# Altium schematic sheet 07-LVDS.SchDoc
size A4; DocumentNumber: 28; SheetNumber: 28; SheetTotal: 34
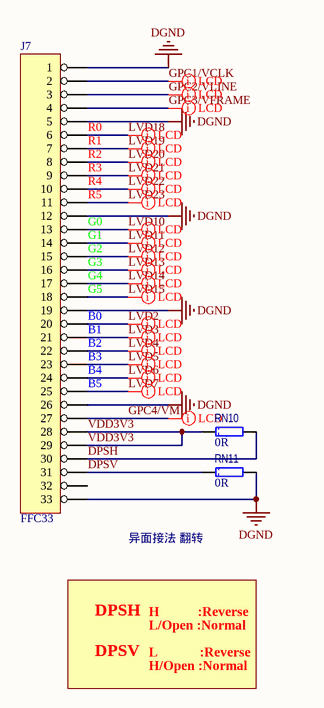
[diagram p0: 07-LVDS.SchDoc]

## Parts
J7  FFC33  [FFC/SM0.5-2H33]
RN10  value 0R  [1608[0603]RN]  (hidden comment: CRCW06030000ZSTA)
RN11  value 0R  [1608[0603]RN]  (hidden comment: CRCW06030000ZSTA)

## Nets
DGND: J7.1 J7.5 J7.12 J7.19 J7.26 J7.33 RN11.2
DPSH: J7.30 RN10.2
DPSV: J7.31 RN11.1
GPC1/VCLK: J7.2
GPC2/VLINE: J7.3
GPC3/VFRAME: J7.4
GPC4/VM: J7.27
LVD2: J7.20
LVD3: J7.21
LVD4: J7.22
LVD5: J7.23
LVD6: J7.24
LVD7: J7.25
LVD10: J7.13
LVD11: J7.14
LVD12: J7.15
LVD13: J7.16
LVD14: J7.17
LVD15: J7.18
LVD18: J7.6
LVD19: J7.7
LVD20: J7.8
LVD21: J7.9
LVD22: J7.10
LVD23: J7.11
VDD3V3: J7.28 J7.29 RN10.1

Not connected (* = marked no-connect by the designer): J7 32

## Layout directives
net class LCD: GPC1/VCLK, GPC2/VLINE, GPC3/VFRAME, GPC4/VM, LVD2, LVD3, LVD4, LVD5, LVD6, LVD7, LVD10, LVD11, LVD12, LVD13, LVD14, LVD15, LVD18, LVD19, LVD20, LVD21, LVD22, LVD23

## Notes on the sheet
- (near J7) R0
- (near J7) R1
- (near J7) R2
- (near J7) R3
- (near J7) R4
- (near J7) R5
- (near J7) G0
- (near J7) G1
- (near J7) G2
- (near J7) G3
- (near J7) G4
- (near J7) G5
- (near J7) B0
- (near J7) B1
- (near J7) B2
- (near J7) B3
- (near J7) B4
- (near J7) B5
- (near J7) 异面接法 翻转
- DPSH
- DPSV
- H           :Reverse
- L/Open :Normal
- L            :Reverse
- H/Open :Normal

## Library data of the parts
J7 = HEADER 33: CON
RN10 RN11 = RES: 厚膜电阻器 - SMD 1/10watt ZEROohm Jumper; Manufacturer: Vishay / Dale; 尺寸: 0.85 mm W x 1.55 mm L x 0.45 mm H; 工作温度范围: - 55 C to + 155 C; 封装 / 箱体: 0603 (1608 metric); 封装: Reel; 功率额定值: 100 mW; 产品: Thick Film Resistors Zero-Ohm; 电阻: 0 Ohms; 系列: CRCW; 温度系数: 200 PPM / C; 端接类型: SMD/SMT; 容差: 1 %; 电压额定值: 75 V; 外壳代码 - in: 0603; 外壳代码 - mm: 1608; 制造商: Vishay; 产品种类: 0603 Thick Film Chip Resistors; 标准包装数量: 5000; Supplier 1: Mouser; Supplier Part Number 1: 71-CRCW0603-0; Manufacturer Part Number: CRCW06030000ZSTA; RoHS: No; Category: 厚膜电阻器 - SMD; Stock 1: 44945; Pricing 1: 1=0.110, 10=0.064, 100=0.036, 1000=0.024, 5000=0.010, 10000=0.009, 25000=0.008, 50000=0.006 (USD); RoHS - 贸泽: N; Minimum Order Quantity: 1; Reeling: True; ComponentLink1URL: http://www.mouser.com/ds/2/427/dcrcw-72725.pdf; ComponentLink1Description: http://www.mouser.com/ds/2/427/dcrcw-72725.pdf; Description 1: 厚膜电阻器 - SMD 1/10watt ZEROohm Jumper